# Altium schematic sheet Connecteurs.SchDoc
size A4
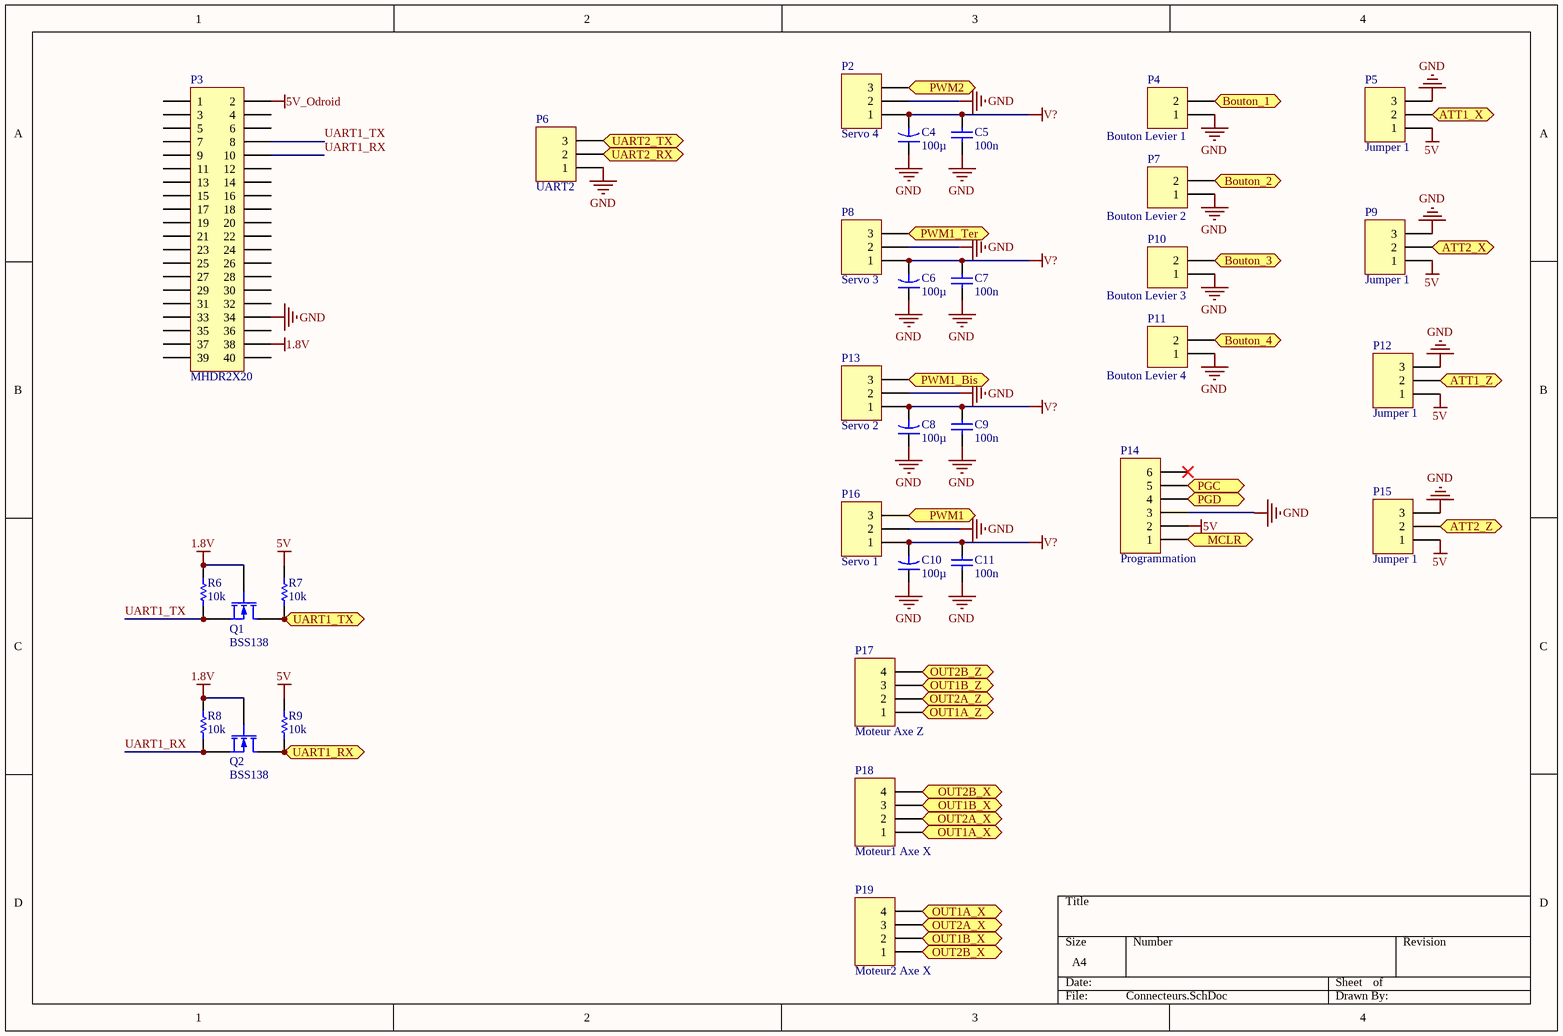
[diagram p0: Connecteurs.SchDoc]

## Parts
C4  value 100µ  [CAPR5-4X5]  (hidden comment: Cap2)
C5  value 100n  [RAD-0.3]  (hidden comment: Cap)
C6  value 100µ  [CAPR5-4X5]  (hidden comment: Cap2)
C7  value 100n  [RAD-0.3]  (hidden comment: Cap)
C8  value 100µ  [CAPR5-4X5]  (hidden comment: Cap2)
C9  value 100n  [RAD-0.3]  (hidden comment: Cap)
C10  value 100µ  [CAPR5-4X5]  (hidden comment: Cap2)
C11  value 100n  [RAD-0.3]  (hidden comment: Cap)
P2  Servo 4  [HDR1X3]
P3  MHDR2X20  [MHDR2X20]
P4  Bouton Levier 1  [HDR1X2]
P5  Jumper 1  [HDR1X3]
P6  UART2  [HDR1X3]
P7  Bouton Levier 2  [HDR1X2]
P8  Servo 3  [HDR1X3]
P9  Jumper 1  [HDR1X3]
P10  Bouton Levier 3  [HDR1X2]
P11  Bouton Levier 4  [HDR1X2]
P12  Jumper 1  [HDR1X3]
P13  Servo 2  [HDR1X3]
P14  Programmation  [HDR1X6]
P15  Jumper 1  [HDR1X3]
P16  Servo 1  [HDR1X3]
P17  Moteur Axe Z  [HDR1X4]
P18  Moteur1 Axe X  [HDR1X4]
P19  Moteur2 Axe X  [HDR1X4]
Q1  BSS138  [E3]
Q2  BSS138  [E3]
R6  value 10k  [AXIAL-0.3]  (hidden comment: Res1)
R7  value 10k  [AXIAL-0.3]  (hidden comment: Res1)
R8  value 10k  [AXIAL-0.3]  (hidden comment: Res1)
R9  value 10k  [AXIAL-0.3]  (hidden comment: Res1)

## Ports
ATT1_X, ATT1_Z, ATT2_X, ATT2_Z, Bouton_1, Bouton_2, Bouton_3, Bouton_4, MCLR, OUT1A_X, OUT1A_Z, OUT1B_X, OUT1B_Z, OUT2A_X, OUT2A_Z, OUT2B_X, OUT2B_Z, PGC, PGD, PWM1, PWM1_Bis, PWM1_Ter, PWM2, UART1_RX, UART1_TX, UART2_RX, UART2_TX

## Nets
1.8V: P3.38 Q1.2(G) Q2.2(G) R6.1 R8.1
5V: P5.1 P9.1 P12.1 P14.2 P15.1 R7.1 R9.1
5V_Odroid: P3.2
GND: C4.1 C5.2 C6.1 C7.2 C8.1 C9.2 C10.1 C11.2 P2.2 P3.34 P4.1 P5.3 P6.1 P7.1 P8.2 P9.3 P10.1 P11.1 P12.3 P13.2 P14.3 P15.3 P16.2
V?: C4.2 C5.1 C6.2 C7.1 C8.2 C9.1 C10.2 C11.1 P2.1 P8.1 P13.1 P16.1
ATT1_X: P5.2 ; port ATT1_X
ATT1_Z: P12.2 ; port ATT1_Z
ATT2_X: P9.2 ; port ATT2_X
ATT2_Z: P15.2 ; port ATT2_Z
Bouton_1: P4.2 ; port Bouton_1
Bouton_2: P7.2 ; port Bouton_2
Bouton_3: P10.2 ; port Bouton_3
Bouton_4: P11.2 ; port Bouton_4
MCLR: P14.1 ; port MCLR
OUT1A_X: P18.1 P19.4 ; port OUT1A_X
OUT1A_Z: P17.1 ; port OUT1A_Z
OUT1B_X: P18.3 P19.2 ; port OUT1B_X
OUT1B_Z: P17.3 ; port OUT1B_Z
OUT2A_X: P18.2 P19.3 ; port OUT2A_X
OUT2A_Z: P17.2 ; port OUT2A_Z
OUT2B_X: P18.4 P19.1 ; port OUT2B_X
OUT2B_Z: P17.4 ; port OUT2B_Z
PGC: P14.5 ; port PGC
PGD: P14.4 ; port PGD
PWM1: P16.3 ; port PWM1
PWM1_Bis: P13.3 ; port PWM1_Bis
PWM1_Ter: P8.3 ; port PWM1_Ter
PWM2: P2.3 ; port PWM2
UART1_RX: P3.10 Q2.3(S) R8.2
UART1_RX: Q2.1(D) R9.2 ; port UART1_RX  [a separate net that carries the same name]
UART1_TX: Q1.1(D) R7.2 ; port UART1_TX
UART1_TX: P3.8 Q1.3(S) R6.2  [a separate net that carries the same name]
UART2_RX: P6.2 ; port UART2_RX
UART2_TX: P6.3 ; port UART2_TX

Not connected (* = marked no-connect by the designer): P3 1 3 4 5 6 7 9 11 12 13 14 15 16 17 18 19 20 21 22 23 24 25 26 27 28 29 30 31 32 33 35 36 37 39 40; P14 6*

## Library data of the parts
C4 C6 C8 C10 = Cap2: Capacitor; Published: 23-Sep-2002; PackageReference: CAPR5-4X5; Publisher: Altium Limited
C5 C7 C9 C11 = Cap: Capacitor; Published: 8-Jun-2000; LatestRevisionDate: 17-Jul-2002; LatestRevisionNote: Re-released for DXP Platform.; PackageReference: RAD-0.3; Publisher: Altium Limited
P2 P5 P6 P8 P9 P12 P13 P15 P16 = Header 3: Header, 3-Pin; LatestRevisionDate: 17-Jul-2002; LatestRevisionNote: Re-released for DXP Platform.; Publisher: Altium Limited
P3 = MHDR2X20: Header, 20-Pin, Dual row; LatestRevisionDate: 17-Jul-2002; LatestRevisionNote: Re-released for DXP Platform.; Publisher: Altium Limited
P4 P7 P10 P11 = Header 2: Header, 2-Pin; LatestRevisionDate: 17-Jul-2002; LatestRevisionNote: Re-released for DXP Platform.; Publisher: Altium Limited
P14 = Header 6: Header, 6-Pin; LatestRevisionDate: 17-Jul-2002; LatestRevisionNote: Re-released for DXP Platform.; Publisher: Altium Limited
P17-P19 = Header 4: Header, 4-Pin; LatestRevisionDate: 17-Jul-2002; LatestRevisionNote: Re-released for DXP Platform.; Publisher: Altium Limited
Q1 Q2 = MOSFET-N: N-Channel MOSFET; Published: 8-Jun-2000; LatestRevisionDate: 17-Jul-2002; LatestRevisionNote: Re-released for DXP Platform.; PackageVersion: 1995/1996; PackageReference: E3; Publisher: Altium Limited; PackageDescription: TO, Flat Index; 3 In-Line, Axial Leads; Body Dia. 4.6mm; Lead Dia. 0.5 mm (max)
R6-R9 = Res1: Resistor; Published: 8-Jun-2000; LatestRevisionDate: 17-Jul-2002; LatestRevisionNote: Re-released for DXP Platform.; PackageReference: AXIAL-0.3; Publisher: Altium Limited